# EAGLE design RE-MB-V2.1 (EAGLE 9.6.2)
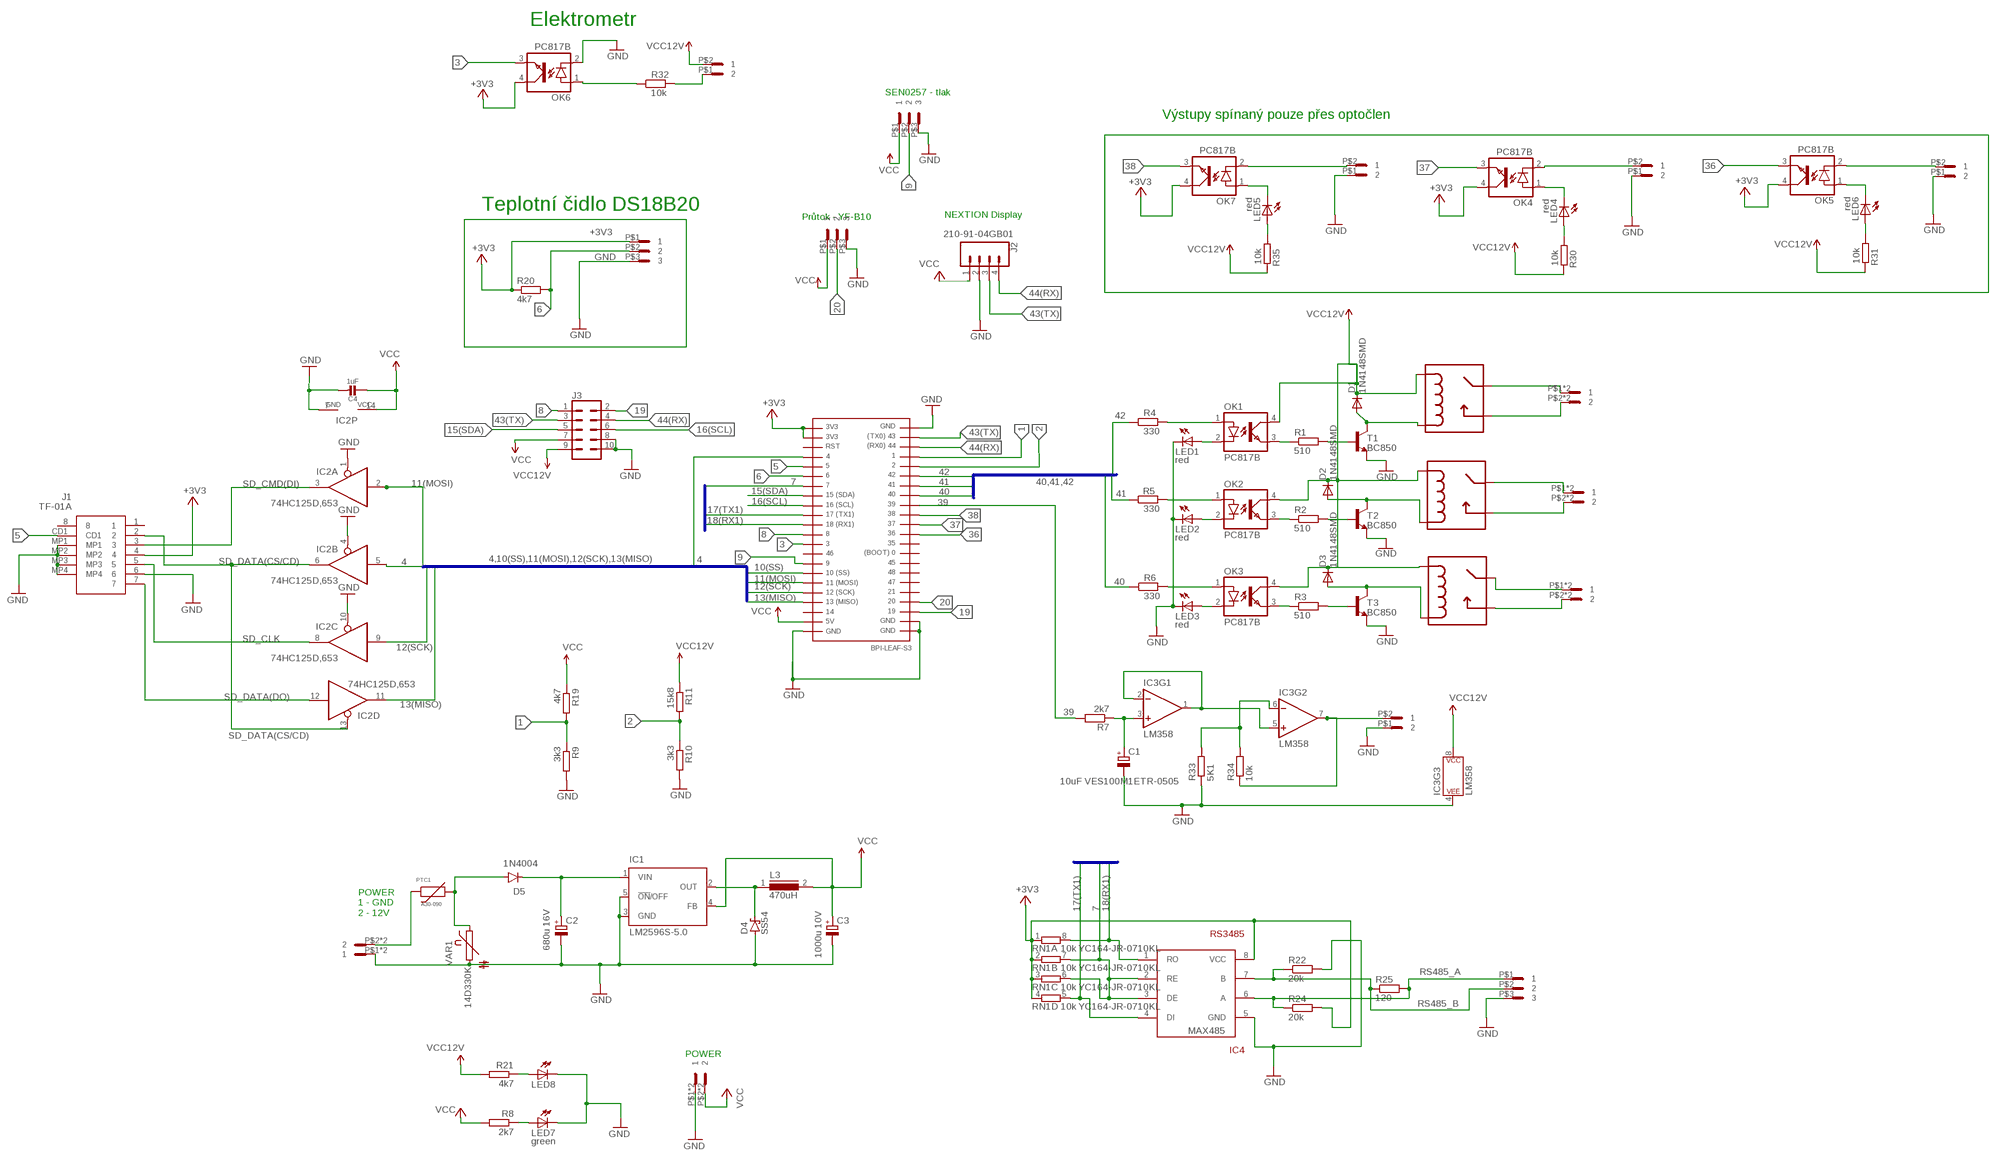
[diagram p0: schematic, sheet 1]

## Parts
BPI  BPI-LEAF-S3  [BPI-LEAF-S3]
C1  10uF VES100M1ETR-0505  CPOL-EUC  [PANASONIC_C]
C2  680u 16V  CPOL-EU153CLV-1010  [153CLV-1010]
C3  1000u 10V  CPOL-EU153CLV-1010  [153CLV-1010]
C4  1uF  CAP_CERAMIC0805-NOOUTLINE  [0805-NO]
D1  1N4148SMD  [DO214AC]
D2  1N4148SMD  [DO214AC]
D3  1N4148SMD  [DO214AC]
D4  SS54  MBRS130LT3  [SMB]
D5  1N4004  [DO41-10]
IC1  LM2596S-5.0  LM2596S  [TO263-5]
IC2  74HC125D,653  74HC125D  [SO14]
IC3  LM358  OPAMP-DUALU  [SO08]
IC4  RS3485  MAX485MAX485ESA  [MAX485]
J1  TF-01A  [TF01A]
J2  210-91-04GB01  CONN_04  [1X04]
J3  CONN_05X2RAF  [2X5-RAF]
K1  HF49FD/012-1H11  HF49FD/024-1H11  [HF49FD/024-1H11]
K2  HF49FD/012-1H11  HF49FD/024-1H11  [HF49FD/024-1H11]
K3  HF49FD/012-1H11  HF49FD/024-1H11  [HF49FD/024-1H11]
L3  470uH  DR127  [DR127]
LED1  red  LEDCHIPLED_0805  [CHIPLED_0805]
LED2  red  LEDCHIPLED_0805  [CHIPLED_0805]
LED3  red  LEDCHIPLED_0805  [CHIPLED_0805]
LED4  red  LEDCHIPLED_0805  [CHIPLED_0805]
LED5  red  LEDCHIPLED_0805  [CHIPLED_0805]
LED6  red  LEDCHIPLED_0805  [CHIPLED_0805]
LED7  green  LEDCHIPLED_0805  [CHIPLED_0805]
LED8  green  LEDCHIPLED_0805  [CHIPLED_0805]
OK1  PC817B  PC817  [DIL04]
OK2  PC817B  PC817  [DIL04]
OK3  PC817B  PC817  [DIL04]
OK4  PC817B  PC817  [DIL04]
OK5  PC817B  PC817  [DIL04]
OK6  PC817B  PC817  [DIL04]
OK7  PC817B  PC817  [DIL04]
PTC1  A30-090  TERMISTORPK250-240  [PK250-240]
R1  510  R-EU_M0805  [M0805]
R2  510  R-EU_M0805  [M0805]
R3  510  R-EU_M0805  [M0805]
R4  330  R-EU_M0805  [M0805]
R5  330  R-EU_M0805  [M0805]
R6  330  R-EU_M0805  [M0805]
R7  2k7  R-EU_R0805  [R0805]
R8  2k7  R-EU_M0805  [M0805]
R9  3k3  R-EU_M0805  [M0805]
R10  3k3  R-EU_M0805  [M0805]
R11  15k8  R-EU_M0805  [M0805]
R19  4k7  R-EU_M0805  [M0805]
R20  4k7  R-EU_M0805  [M0805]
R21  4k7  R-EU_M0805  [M0805]
R22  20k  R-EU_R0805  [R0805]
R24  20k  R-EU_R0805  [R0805]
R25  120  R-EU_R0805  [R0805]
R30  10k  R-EU_M0805  [M0805]
R31  10k  R-EU_M0805  [M0805]
R32  10k  R-EU_M0805  [M0805]
R33  5K1  R-EU_R0805  [R0805]
R34  10k  R-EU_R0805  [R0805]
R35  10k  R-EU_M0805  [M0805]
RN1  10k YC164-JR-0710KL  4R-N0603-ARV  [0603-ARV]
T1  BC850  [SOT23]
T2  BC850  [SOT23]
T3  BC850  [SOT23]
U$2  DG235-5.0  [DG235-5.0]
U$3  SPTA1/3-5,0  [SPTA1/3-5,0]
U$4  DG235-5.0  [DG235-5.0]
U$5  DG235-5.0  [DG235-5.0]
U$6  DG235-5.0  [DG235-5.0]
U$7  DG235-5.0  [DG235-5.0]
U$8  SPTA1/2-5,0  [SPTA1/2-5,0]
U$9  SPTA1/2-5,0  [SPTA1/2-5,0]
U$10  SPTA1/3-5,0  [SPTA1/3-5,0]
U$12  SPTA1/3-5,0  [SPTA1/3-5,0]
U$13  SPTA1/2-5,0  [SPTA1/2-5,0]
U$14  SPTA1/2-5,0  [SPTA1/2-5,0]
U$15  SPTA1/2-5,0  [SPTA1/2-5,0]
U$16  SPTA1/3-5,0  [SPTA1/3-5,0]
VAR1  14D330K  S10K11  [S10K11]

## Nets
1: BPI.26 R9.1 R19.2
2: BPI.27 R10.1 R11.2
3: BPI.13 OK6.3(EMIT)
4: BPI.4 IC2.5(B:I)
5: BPI.5 J1.CD1
6: BPI.6 R20.2 U$3.P$2
7: BPI.7 IC4.2(RE) IC4.3(DE) RN1.6 RN1.7
8: BPI.12 J3.1
9: BPI.15 U$12.P$2
10(SS): BPI.16
11(MOSI): BPI.17 IC2.2(A:I)
12(SCK): BPI.18 IC2.9(C:I)
13(MISO): BPI.19 IC2.11(D:O)
15(SDA): BPI.8 J3.5
16(SCL): BPI.9 J3.6
17(TX1): BPI.10 IC4.4(DI) RN1.5
18(RX1): BPI.11 IC4.1(RO) RN1.8
19: BPI.42 J3.2
20: BPI.41 U$16.P$2
36: BPI.34 OK5.3(EMIT)
37: BPI.33 OK4.3(EMIT)
38: BPI.32 OK7.3(EMIT)
39: BPI.31 R7.2
40: BPI.30 R6.1
41: BPI.29 R5.1
42: BPI.28 R4.1
43(TX): BPI.24 J2.3 J3.3
44(RX): BPI.25 J2.4 J3.4
+3V3: BPI.1 BPI.2 IC4.8(VCC) J1.4 OK4.4(COL) OK5.4(COL) OK6.4(COL) OK7.4(COL) R20.1 R24.2 RN1.1 RN1.2 RN1.3 RN1.4 U$3.P$1
GND: BPI.22 BPI.23 BPI.43 BPI.44 C1.- C2.- C3.- C4.2 D4.A IC1.3(GND) IC1.5(!ON!/OFF) IC2.1(A:OE) IC2.4(B:OE) IC2.7(P:GND) IC2.10(C:OE) IC3.4(P$V-) IC4.5(GND) J1.6 J1.MP1 J1.MP2 J1.MP3 J1.MP4 J2.2 J3.8 J3.10 LED1.C LED2.C LED3.C LED7.C LED8.C OK6.2(C) R9.2 R10.2 R22.2 R33.1 T1.2(E) T2.2(E) T3.2(E) U$2.P$1 U$2.P$3 U$3.P$3 U$6.P$1 U$6.P$3 U$8.P$1 U$10.P$3 U$12.P$3 U$13.P$1 U$14.P$1 U$15.P$1 U$16.P$3 VAR1.2
GND1: OK4.2(C) U$13.P$2
N$1: PTC1.P$1 U$2.P$2 U$2.P$4
N$2: K1.P$1 U$4.P$1 U$4.P$3
N$3: D5.A PTC1.P$2 VAR1.1
N$5: K1.P$2 U$4.P$2 U$4.P$4
N$6: K2.P$1 U$5.P$1 U$5.P$3
N$7: K2.P$2 U$5.P$2 U$5.P$4
N$8: K3.P$1 U$7.P$1 U$7.P$3
N$9: K3.P$2 U$7.P$2 U$7.P$4
N$10: OK7.2(C) U$15.P$2
N$11: LED4.C OK4.1(A)
N$12: LED4.A R30.1
N$13: OK5.2(C) U$14.P$2
N$14: LED6.C OK5.1(A)
N$15: LED6.A R31.1
N$16: OK6.1(A) R32.1
N$17: LED1.A OK1.2(C)
N$18: D1.A K1.P$4 T1.3(C)
N$19: OK1.3(EMIT) R1.1
N$20: C1.+ IC3.3(+IN) R7.1
N$22: IC3.1(OUT) IC3.2(-IN) IC3.5(+IN)
N$23: R1.2 T1.1(B)
N$24: R32.2 U$9.P$1
N$25: LED7.A R8.1
N$29: OK1.1(A) R4.2
N$33: LED8.A R21.1
N$40: D4.C IC1.2(OUT) L3.1
N$41: IC3.6(-IN) R33.2 R34.2
N$42: IC3.7(OUT) R34.1 U$8.P$2
N$51: LED2.A OK2.2(C)
N$52: LED3.A OK3.2(C)
N$58: OK3.1(A) R6.2
N$59: OK2.1(A) R5.2
N$65: OK2.3(EMIT) R2.1
N$66: OK3.3(EMIT) R3.1
N$77: R3.2 T3.1(B)
N$78: R2.2 T2.1(B)
N$79: D2.A K2.P$4 T2.3(C)
N$80: D3.A K3.P$4 T3.3(C)
N$91: LED5.C OK7.1(A)
N$92: LED5.A R35.1
RS485_A: IC4.6(A) R24.1 R25.2 U$10.P$1
RS485_B: IC4.7(B) R22.1 R25.1 U$10.P$2
SD_CLK: IC2.8(C:O) J1.5
SD_CMD(DI): IC2.3(A:O) J1.3
SD_DATA(CS/CD): IC2.6(B:O) IC2.13(D:OE) J1.2
SD_DATA(DO): IC2.12(D:I) J1.7
VCC: BPI.21 C3.+ C4.1 IC1.4(FB) IC2.14(P:VCC) J2.1 J3.7 L3.2 R8.2 R19.1 U$6.P$2 U$6.P$4 U$12.P$1 U$16.P$1
VCC12V: C2.+ D1.C D2.C D3.C D5.C IC1.1(VIN) IC3.8(P$V+) J3.9 K1.P$3 K2.P$3 K3.P$3 OK1.4(COL) OK2.4(COL) OK3.4(COL) R11.1 R21.2 R30.2 R31.2 R35.2 U$9.P$2
Unconnected: BPI.3 BPI.14 BPI.20 BPI.35 BPI.36 BPI.37 BPI.38 BPI.39 BPI.40 J1.1 J1.8

## Buses
4,10(SS),11(MOSI),12(SCK),13(MISO)
40,41,42
7,17(TX1),18(RX1)

## Notes on the sheet
- Elektrometr
- SEN0257 - tlak
- Výstupy spínaný pouze přes optočlen
- Teplotní čidlo DS18B20 | NEXTION Display
- Průtok - YF-B10
- POWER
  1 - GND
  2 - 12V
- POWER

## Library data of the parts
BPI = SparkFun-Connectors:BPI-LEAF-S3
C1 = resistor:CPOL-EU: POLARIZED CAPACITOR, European symbol
C2 C3 = rcl:CPOL-EU: POLARIZED CAPACITOR, European symbol
C4 = microbuilder:CAP_CERAMIC: Ceramic Capacitors For new designs, use the packages preceded by an '_' character since they are more reliable: The following footprints should be used on most boards: _0402 - Standard footprint for regular board layouts _0603 - Standard footprint for regular board layouts _0805 - Standard footprint for regular board layouts _1206 - Standard footprint for regular board layouts For extremely tight-pitch boards where space is at a premium, the following 'micro-pitch' footprints can be used (smaller pads, no silkscreen outline, etc.): _0402MP - Micro-pitch footprint for very dense/compact boards _0603MP - Micro-pitch footprint for very dense/compact boards _0805MP - Micro-pitch footprint for very dense/compact boards _1206MP - Micro-pitch footprint for very dense/compact boards
D1-D3 = diode-1:1N4148: DIODE high speed (Philips)
D4 = diode:MBRS130LT3: Schottky Power Rectifier Source: http://www.onsemi.com/pub/Collateral/MBRS130LT3-D.PDF
D5 = diode:1N4004: DIODE general purpose rectifier, 1 A
IC1 = national-semiconductor:LM2596: SIMPLE SWITCHER® Power Converter 150 kHz 3A Step-Down Voltage Regulator Source: http://www.national.com/ds/LM/LM2596.pdf; MF: NATIONAL SEMICONDUCTOR; MPN: LM2596S-ADJ/NOPB; OC_FARNELL: 9494367; OC_NEWARK: 41K3842
IC2 = 74xx-eu:74*125: Quad bus BUFFER, 3-state; SPICEPREFIX: J
IC3 = SparkFun-IC-Amplifiers:OPAMP-DUAL: Generic op-amp footprint This component is for the standard 358 pinning of a dual op-amp From the LM358 datasheet: Pin 1: Output A Pin 2: Inverting Input A Pin 3: Non-Inverting Input A Pin 4: Gnd Pin 5: Non-Inverting Input B Pin 6: Inverting Input B Pin 7: Output B Pin 8: V+; PROD_ID: NA-XXXXX; VALUE: OP-AMP
IC4 = gasparik:MAX485
J1 = TF-01A:TF-01A: Connector - Card Sockets 8 1.1mm SMD RoHS Source: Datasheet <https://datasheet.lcsc.com/szlcsc/1903221101_Korean-Hroparts-Elec-TF-01A_C91145.pdf>; DESCRIPTION: Connector - Card Sockets 8 1.1mm SMD RoHS; HEIGHT: 1.85mm; MANUFACTURER_NAME: Korean Hroparts Elec; MANUFACTURER_PART_NUMBER: TF-01A
J2 = SparkFun-Connectors:CONN_04: Multi connection point. Often used as Generic Header-pin footprint for 0.1 inch spaced/style header connections On any of the 0.1 inch spaced packages, you can populate with these: Break Away Headers - Straight <https://www.sparkfun.com/products/116> (PRT-00116) Break Away Male Headers - Right Angle <https://www.sparkfun.com/products/553> (PRT-00553) Female Headers <https://www.sparkfun.com/products/115> (PRT-00115) Break Away Headers - Machine Pin <https://www.sparkfun.com/products/117> (PRT-00117) Break Away Female Headers - Swiss Machine Pin <https://www.sparkfun.com/products/743> (PRT-00743) For SCREWTERMINALS and SPRING TERMINALS visit here: Screw Terimnals on SparkFun.com <https://www.sparkfun.com/search/results?term=Screw+Terminals> (5mm/3.5mm/2.54mm spacing) This device is also useful as a general connection point to wire up your design to another part of your project. Our various solder wires solder well into these plated through hole pads. Hook-Up Wire - Assortment (Stranded, 22 AWG) <https://www.sparkfun.com/products/11375> (PRT-11375) Hook-Up Wire - Assortment (Solid Core, 22 AWG) <https://www.sparkfun.com/products/11367> (PRT-11367) View the entire wire category on our website here <https://www.sparkfun.com/categories/141> Special notes: Molex polarized connector foot print use with SKU : PRT-08231 with associated crimp pins and housings. 1MM SMD Version SKU: PRT-10208; PROD_ID: CONN-09696
J3 = SparkFun-Connectors:CONN_05X2: Multi connection point. Often used as Generic Header-pin footprint for 0.1 inch spaced/style header connections For AVR SPI programming port, see special device with nice symbol: "AVR_SPI_PROG_5x2.dev" You can populate with any combo of single row headers, but if you'd like an exact match, check these: 2x5 AVR ICSP Male Header <https://www.sparkfun.com/products/778> (PRT-00778) 2x5 Pin Shrouded Header <https://www.sparkfun.com/products/8506> (PRT-08506) On any of the 0.1 inch spaced packages, you can populate with these: Break Away Headers - Straight <https://www.sparkfun.com/products/116> (PRT-00116) Break Away Male Headers - Right Angle <https://www.sparkfun.com/products/553> (PRT-00553) Female Headers <https://www.sparkfun.com/products/115> (PRT-00115) Break Away Headers - Machine Pin <https://www.sparkfun.com/products/117> (PRT-00117) Break Away Female Headers - Swiss Machine Pin <https://www.sparkfun.com/products/743> (PRT-00743) Special note: the shrouded connector mates well with our 5x2 ribbon cables: 2x5 Pin IDC Ribbon Cable <https://www.sparkfun.com/products/8535> (PRT-08535)
K1-K3 = HF49FD0241H11:HF49FD/024-1H11
L3 = inductors:DR127: High Power Density, High Efficiency, Shielded Inductors Source: coiltronics_dr_series.pdf; SPICEPREFIX: L
LED1-LED8 = adafruit:LED: LED OSRAM: - CHIPLED LG R971, LG N971, LY N971, LG Q971, LY Q971, LO R971, LY R971 LH N974, LH R974 LS Q976, LO Q976, LY Q976 LO Q996 - Hyper CHIPLED LW Q18S LB Q993, LB Q99A, LB R99A - SideLED LS A670, LO A670, LY A670, LG A670, LP A670 LB A673, LV A673, LT A673, LW A673 LH A674 LY A675 LS A676, LA A676, LO A676, LY A676, LW A676 LS A679, LY A679, LG A679 - Hyper Micro SIDELED® LS Y876, LA Y876, LO Y876, LY Y876 LT Y87S - SmartLED LW L88C, LW L88S LB L89C, LB L89S, LG L890 LS L89K, LO L89K, LY L89K LS L896, LA L896, LO L896, LY L896 - TOPLED LS T670, LO T670, LY T670, LG T670, LP T670 LSG T670, LSP T670, LSY T670, LOP T670, LYG T670 LG T671, LOG T671, LSG T671 LB T673, LV T673, LT T673, LW T673 LH T674 LS T676, LA T676, LO T676, LY T676, LB T676, LH T676, LSB T676, LW T676 LB T67C, LV T67C, LT T67C, LS T67K, LO T67K, LY T67K, LW E67C LS E67B, LA E67B, LO E67B, LY E67B, LB E67C, LV E67C, LT E67C LW T67C LS T679, LY T679, LG T679 LS T770, LO T770, LY T770, LG T770, LP T770 LB T773, LV T773, LT T773, LW T773 LH T774 LS E675, LA E675, LY E675, LS T675 LS T776, LA T776, LO T776, LY T776, LB T776 LHGB T686 LT T68C, LB T68C - Hyper Mini TOPLED® LB M676 - Mini TOPLED Santana® LG M470 LS M47K, LO M47K, LY M47K Source: http://www.osram.convergy.de/
OK1-OK7 = optocoupler:PC817: SHARP OPTO COUPLER; MPN: PC817X4J000F; OC_FARNELL: 9707727; OC_NEWARK: 97K7059
PTC1 = gasparik:TERMISTOR
R1-R11 R19-R22 R24 R25 R30-R35 = resistor:R-EU_: RESISTOR, European symbol
RN1 = resistor-dil:4R-N: Array Chip Resistor Source: RS Component / Phycomp; OC_FARNELL: unknown; OC_NEWARK: unknown
T1-T3 = transistor:BC850: NPN TRANSISTOR
U$2 U$4-U$7 = SparkFun-Connectors:DG235-5.0
U$3 U$10 U$12 U$16 = SparkFun-Connectors:SPTA1/3-5,0
U$8 U$9 U$13-U$15 = SparkFun-Connectors:SPTA1/2-5,0
VAR1 = varistor:S10K11: VARISTOR

## Board
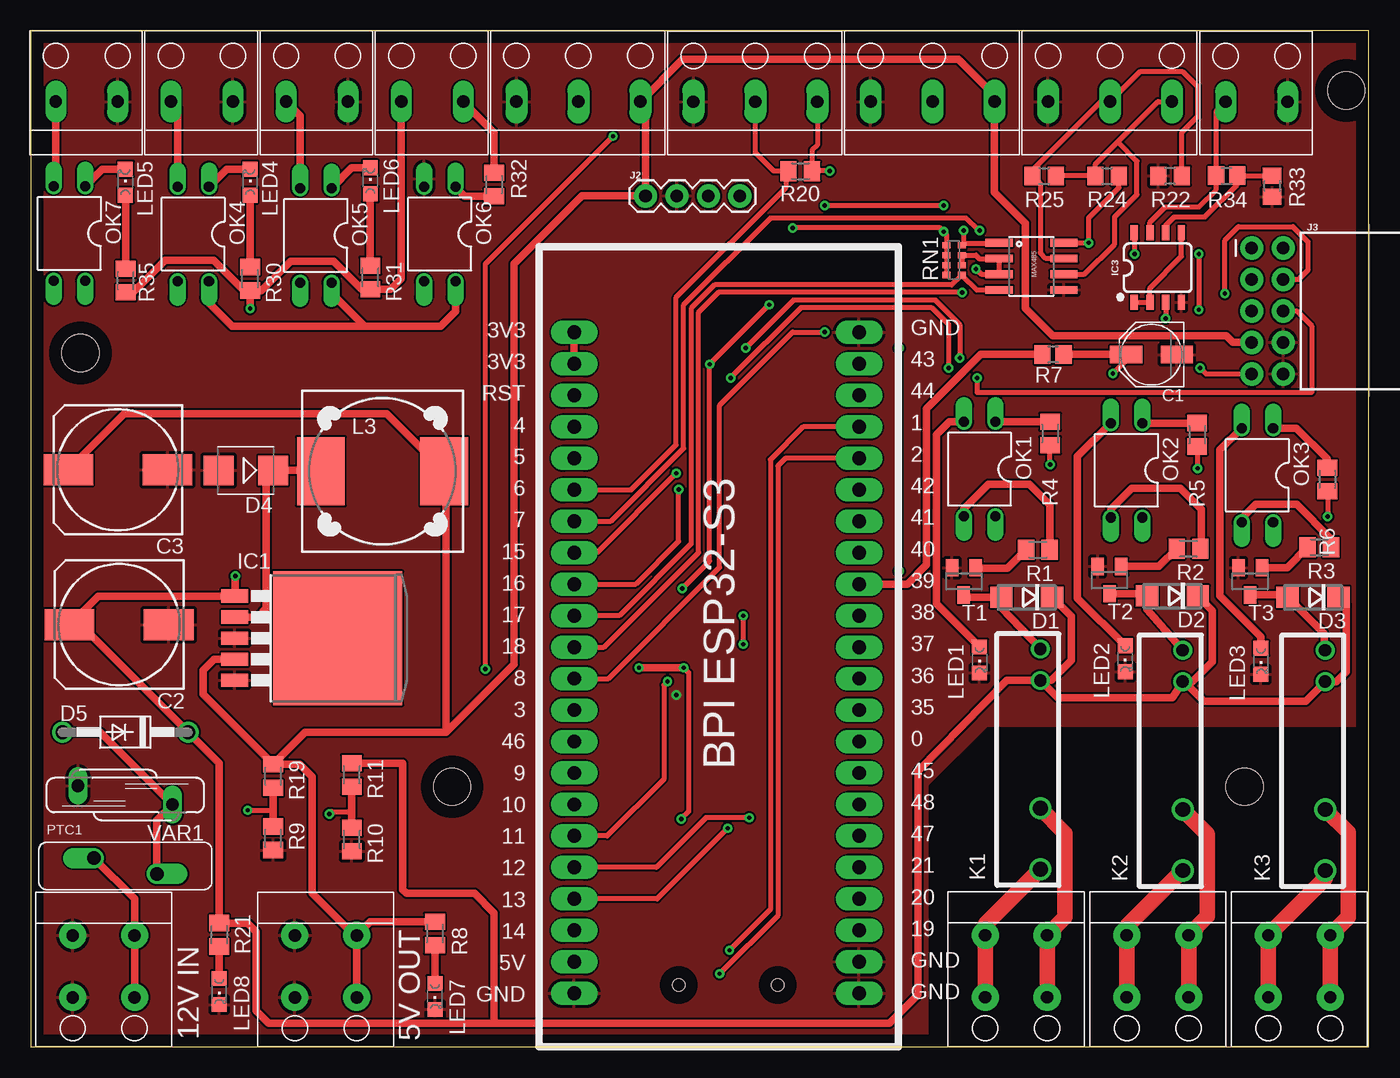
[diagram p1: board, top side]
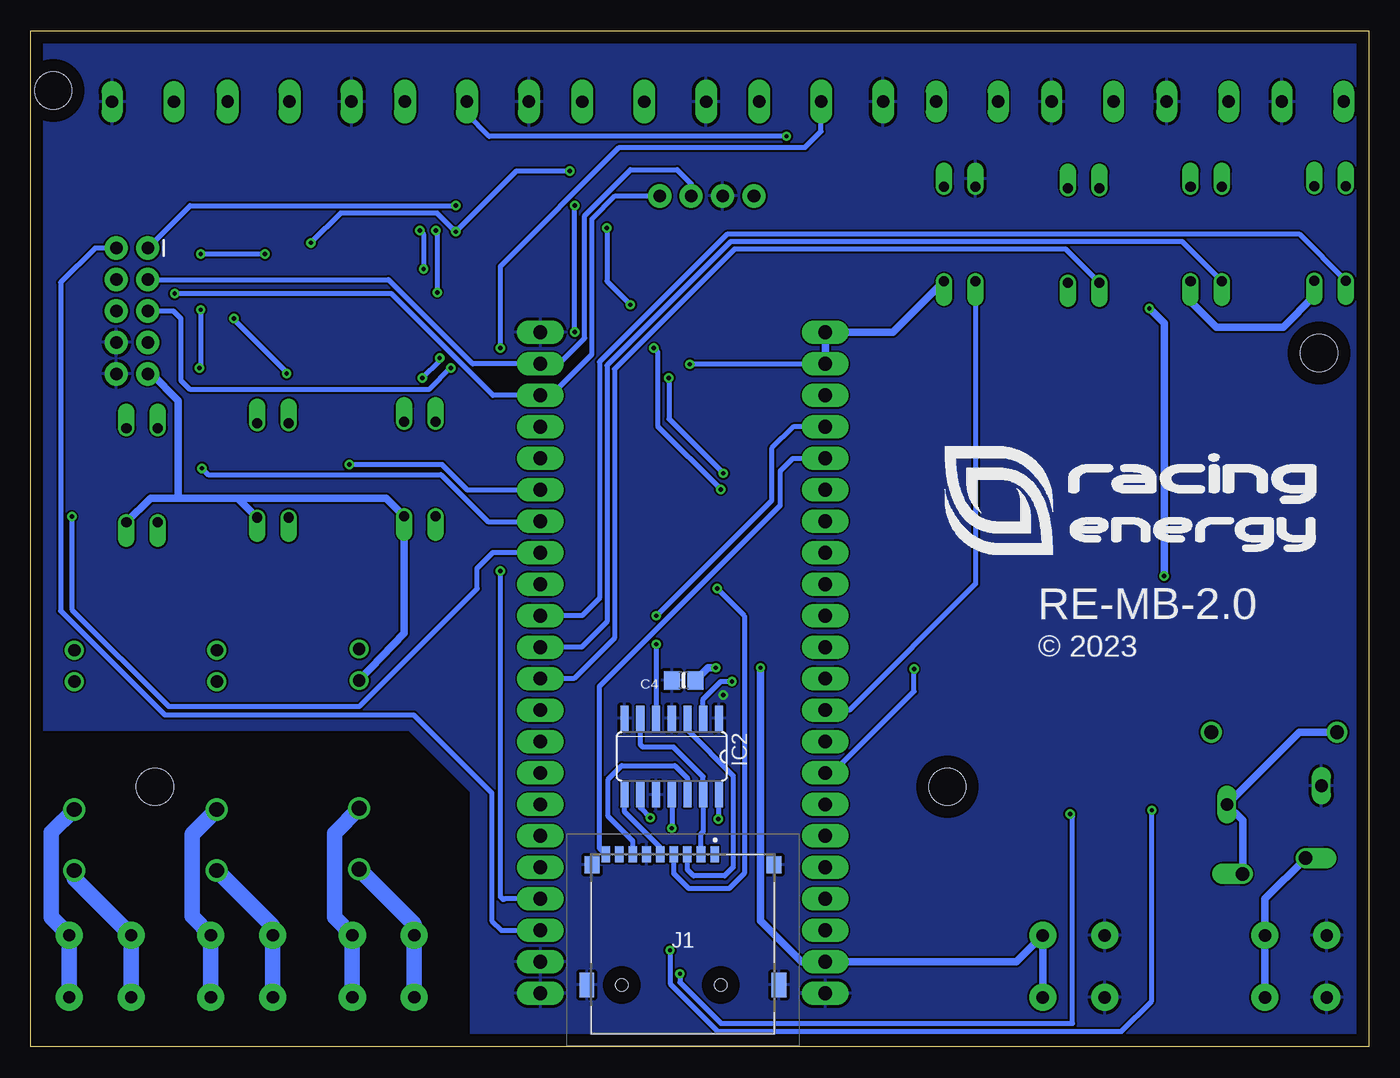
[diagram p2: board, bottom side, seen from below]

Size 108 x 82 mm. Coordinates in mm from the lower left corner, seen from the top.
Outline: 0,0 108,0 108,82 0,82 0,0
Copper layers (1*16): Top 0.035mm / dielectric 1.5mm / Bottom 0.035mm
Design rules "default": minimum track width 6mil, minimum drill 0.35mm, track to track 6mil, track to pad 6mil, pad to pad 6mil, via to via 6mil, smd to smd 6mil, copper to edge 40mil, drill to drill 6mil, minimum pad ring 10mil, minimum via ring 8mil, stop-mask expansion 4mil, vias tented up to drill 0mil, thermal gap 10mil
Holes 3 mm at 4,56 98,21 34,21 106.2,77.2

### Footprints (pad centres in the part's own frame; a part is rotated, then mirrored left to right if it is on the bottom)
BPI-LEAF-S3 = drill 1.118 pad 1.88 long: 1 -11.46,24.65; 2 -11.46,22.11; 3 -11.46,19.57; 4 -11.46,17.03; 5 -11.46,14.49; 6 -11.46,11.95; 7 -11.46,9.41; 8 -11.46,6.87; 9 -11.46,4.33; 10 -11.46,1.79; 11 -11.46,-0.75; 12 -11.46,-3.29; 13 -11.46,-5.83; 14 -11.46,-8.37; 15 -11.46,-10.91; 16 -11.46,-13.45; 17 -11.46,-15.99; 18 -11.46,-18.53; 19 -11.46,-21.07; 20 -11.46,-23.61; 21 -11.46,-26.15; 22 -11.46,-28.69; 23 11.54,24.65; 24 11.54,22.11; 25 11.54,19.57; 26 11.54,17.03; 27 11.54,14.49; 28 11.54,11.95; 29 11.54,9.41; 30 11.54,6.87; 31 11.54,4.33; 32 11.54,1.79; 33 11.54,-0.75; 34 11.54,-3.29; 35 11.54,-5.83; 36 11.54,-8.37; 37 11.54,-10.91; 38 11.54,-13.45; 39 11.54,-15.99; 40 11.54,-18.53; 41 11.54,-21.07; 42 11.54,-23.61; 43 11.54,-26.15; 44 11.54,-28.69
PANASONIC_C = smd 2.6 x 1.4: + 2.05,0; - -2.05,0
153CLV-1010 = smd 4 x 2.5: + 4,0; - -4,0
0805-NO = smd 1.3 x 1.5: 1 -0.95,0; 2 0.95,0
DO214AC = smd 1.8 x 1.7: A 2.05,0; C -2.05,0
SMB = smd 2.4 x 2.4: A 2.2,0; C -2.2,0
DO41-10 = drill 1.118: A 5.08,0; C -5.08,0
TO263-5 = smd 1.067 x 2.159: 1 -3.404,-5.791; 2 -1.702,-5.791; 3 0,-5.791; 4 1.702,-5.791; 5 3.404,-5.791 | smd 10.8 x 10.41: 6 0,2.54
SO14 = smd 0.66 x 2.032: 1 -3.81,-3.073; 2 -2.54,-3.073; 3 -1.27,-3.073; 4 0,-3.073; 5 1.27,-3.073; 6 2.54,-3.073; 7 3.81,-3.073; 8 3.81,3.073; 9 2.54,3.073; 10 1.27,3.073; 11 0,3.073; 12 -1.27,3.073; 13 -2.54,3.073; 14 -3.81,3.073
SO08 = smd 0.6 x 1.2: 1 -1.905,-2.8; 2 -0.635,-2.8; 3 0.635,-2.8; 4 1.905,-2.8; 5 1.905,2.8; 6 0.635,2.8; 7 -0.635,2.8; 8 -1.905,2.8
MAX485 = smd 0.61 x 2.21: 1 1.905,-6.426; 2 3.175,-6.426; 3 4.445,-6.426; 4 5.715,-6.426; 5 5.715,-1.194; 6 4.445,-1.194; 7 3.175,-1.194; 8 1.905,-1.194
TF01A = smd 0.7 x 1.3: 1 2.56,7.25; 2 1.46,7.25; 3 0.36,7.25; 4 -0.74,7.25; 5 -1.84,7.25; 6 -2.94,7.25; 7 -4.04,7.25; 8 -5.14,7.25; CD1 -6.24,7.25 | smd 1.2 x 1.4: MP1 -7.34,6.4; MP4 7.34,6.4 | smd 1.2 x 2: MP2 -7.76,-3.3; MP3 7.76,-3.3 | hole 1: -4.95,-3.3; 3.05,-3.3
1X04 = drill 1.016 pad 1.88: 1 0,0; 2 2.54,0; 3 5.08,0; 4 7.62,0
2X5-RAF = drill 1.016 pad 1.88: 1 -1.27,5.08; 2 1.27,5.08; 3 -1.27,2.54; 4 1.27,2.54; 5 -1.27,0; 6 1.27,0; 7 -1.27,-2.54; 8 1.27,-2.54; 9 -1.27,-5.08; 10 1.27,-5.08
HF49FD/024-1H11 = drill 1.2: P$1 -8,0; P$2 -3.08,0 | drill 1: P$3 7.24,0; P$4 9.78,0
DR127 = smd 3.85 x 5.5: 1 -4.975,0; 2 4.975,0
CHIPLED_0805 = smd 1.2 x 1.2: A 0,-1.05; C 0,1.05
DIL04 = drill 0.813 offset: 1 -1.27,-3.81; 2 1.27,-3.81; 3 1.27,3.81; 4 -1.27,3.81
PK250-240 = drill 1.1 offset: P$1 -2.54,1.27; P$2 2.54,0
M0805 = smd 1.3 x 1.6: 1 -0.95,0; 2 0.95,0
R0805 = smd 1.3 x 1.5: 1 -0.85,0; 2 0.85,0
R0805' = smd 1.3 x 1.5: 1 -0.95,0; 2 0.95,0
0603-ARV = smd 0.5 x 0.65: 1 -1.2,-0.625; 2 -0.4,-0.625; 3 0.4,-0.625; 4 1.2,-0.625; 5 1.2,0.625; 6 0.4,0.625; 7 -0.4,0.625; 8 -1.2,0.625
SOT23 = smd 1 x 1.4: 1 -0.95,-1.1; 2 0.95,-1.1; 3 0,1.1
DG235-5.0 = drill 1 pad 2.184: P$1 3,4; P$2 8,4; P$3 3,9; P$4 8,9
SPTA1/3-5,0 = drill 1 pad 1.778 long: P$1 2,5.7; P$2 7,5.7; P$3 12,5.7
SPTA1/2-5,0 = drill 1 pad 1.676 long: P$1 2,5.7; P$2 7,5.7
S10K11 = drill 1.016 long: 1 -0.762,-3.81; 2 0.762,3.81

### Placement (x,y rotation side)
BPI  55.33,33.02 0 top
C1  90.48,55.88 180 top
C2  7.12,34.09 180 top
C3  7.02,46.59 180 top
C4  55.3,29.59 180 bottom
D1  80.4,36.31 180 top
D2  92.16,36.41 180 top
D3  103.52,36.31 180 top
D4  17.35,46.53 180 top
D5  7.62,25.4 180 top
IC1  22.23,32.99 270 top
IC2  56.26,23.44 180 bottom
IC3  90.98,62.9 0 top
IC4  84.59,66.81 270 top
J1  55.36,8.3 0 bottom
J2  49.62,68.68 0 top
J3  99.84,59.4 0 top
K1  81.5,22.34 90 top
K2  93,22.24 90 top
K3  104.5,22.24 90 top
L3  28.38,46.46 0 top
LED1  76.59,31.23 180 top
LED2  88.35,31.33 180 top
LED3  99.31,31.13 180 top
LED4  17.7,69.8 0 top
LED5  7.62,69.8 0 top
LED6  27.4,69.9 0 top
LED7  32.62,4.07 180 top
LED8  15.2,4.47 180 top
OK1  76.6,46.64 180 top
OK2  88.46,46.54 180 top
OK3  99.02,46.14 180 top
OK4  13.1,65.6 180 top
OK5  23,65.5 180 top
OK6  33,65.6 180 top
OK7  3.1,65.66 180 top
PTC1  7.62,13.97 0 top
R1  81.3,40.12 180 top
R2  93.46,40.22 180 top
R3  104.02,40.32 180 top
R4  82.29,49.51 90 top
R5  94.16,49.41 90 top
R6  104.67,45.81 90 top
R7  82.53,55.89 180 top
R8  32.62,9.15 90 top
R9  19.56,16.84 270 top
R10  25.91,16.74 270 top
R11  25.91,21.96 270 top
R19  19.56,21.86 270 top
R20  62.12,70.68 180 top
R21  15.2,9.05 90 top
R22  20k  [R0805']  91.98,70.3 180 top
R24  20k  [R0805']  86.9,70.3 0 top
R25  120  [R0805']  81.82,70.3 0 top
R30  17.7,62 270 top
R31  27.4,62.1 270 top
R32  37.4,69.6 90 top
R33  100.22,69.48 90 top
R34  96.54,70.32 0 top
R35  7.65,61.85 270 top
RN1  74.53,63.5 270 top
T1  75.32,37.58 180 top
T2  87.08,37.68 180 top
T3  98.44,37.58 180 top
U$2  0.37,0 0 top
U$3  65.49,81.99 180 top
U$4  74.05,0.01 0 top
U$5  85.48,0.01 0 top
U$6  18.3,0 0 top
U$7  96.91,0.01 0 top
U$8  103.46,81.99 180 top
U$9  36.9,82 180 top
U$10  94.12,82 180 top
U$12  79.8,82 180 top
U$13  18.3,82 180 top
U$14  27.6,82 180 top
U$15  9,82 180 top
U$16  51.2,82 180 top
VAR1  7.62,20.32 90 top

### Tracks (layer width: path | path; a pad name or v marks a point on that pad's centre or on a via)
1  (via drill 0.35)
  Top 0.406: BPI.26 62.35,50.05 59.7,47.4 59.7,11.1 v56.4,7.8 | v17.5,19.1 19.56,19.1
  Top 0.61: R19.2 19.56,19.1 R9.1
  Bottom 0.406: v56.4,7.8 56.4,5.1 52.56,1.26 19.94,1.26 17.5,3.7 v17.5,19.1
2  (via drill 0.35)
  Top 0.406: BPI.27 60.91,47.51 60.3,46.9 60.3,10.6 v55.6,5.9 | v24.1,18.8 24.3,19 25.91,19
  Top 0.61: R11.2 25.91,19 R10.1
  Bottom 0.406: v55.6,5.9 55.6,5.2 52.3,1.9 23.9,1.9 23.9,18.6 v24.1,18.8
3
  Bottom 0.406: OK6.3 31.73,37.37 41.91,27.19 BPI.13
4  (via drill 0.35)
  Top 0.406: v57.5,34.8 v57.5,32.5
  Bottom 0.406: BPI.4 46.45,50.05 48.2,48.3 48.2,44.1 v57.5,34.8 | v57.5,32.5 57.53,32.47 IC2.5
5
  Bottom 0.406: J1.CD1 62.1,16.05 62.1,29.1 47.5,43.7 47.5,46.5 46.49,47.51 BPI.5
6
  Top 0.406: BPI.6 48.47,44.97 52.1,48.6 52.1,60.5 61,69.4 61,70.68 | R20.2 61,70.68 | 61,70.68 59.98,70.68 58.49,72.17 U$3.P$2
7  (via drill 0.35)
  Top 0.406: BPI.7 46.83,42.43 52.7,48.3 52.7,59.9 59.7,66.9 75.5,66.9 76.5,65.9 v76.6,65.9 | v76.3,62.8 76.73,62.37 IC4.3 IC4.2 78.13,63.6 76.6,63.6 76.3,63.9 RN1.7 RN1.6
  Bottom 0.406: v76.6,65.9 76.3,65.6 v76.3,62.8
8  (via drill 0.35)
  Top 0.406: BPI.12 46.63,29.73 55.6,38.7 55.6,51.8 61.5,57.7 v64.1,57.7 | v73.7,67.9 v64.1,67.9
  Bottom 0.406: J3.1 95.15,67.9 v73.7,67.9 | v64.1,57.7 v64.1,67.9
9  (via drill 0.35)
  Top 0.406: v36.7,30.5 36.7,63.2 v47,73.5
  Bottom 0.406: BPI.15 43.29,22.11 36.7,28.7 v36.7,30.5 | v47,73.5 71,73.5 72.8,75.3 U$12.P$2
11(MOSI)  (via drill 0.35)
  Top 0.406: v51.4,29.5 51.1,29.2 51.1,21.6 46.53,17.03 BPI.17
  Bottom 0.406: IC2.2 53.72,28.08 52.3,29.5 v51.4,29.5
12(SCK)  (via drill 0.35)
  Top 0.406: BPI.18 50.49,14.49 54.5,18.5 v58,18.5
  Bottom 0.406: IC2.9 58.8,19.3 v58,18.5
13(MISO)  (via drill 0.35)
  Top 0.406: v56.25,17.65 50.55,11.95 BPI.19
  Bottom 0.406: IC2.11 v56.26,17.65 v56.25,17.65
15(SDA)  (via drill 0.35)
  Top 0.406: BPI.8 45.69,39.89 v52.1,46.3 | v56.5,54 62.2,59.7 72.7,59.7 74.1,58.3 v74.1,54.8
  Bottom 0.406: J3.5 96.5,59.4 95.9,58.8 95.9,53.8 95.2,53.1 75.8,53.1 v74.1,54.8 | v52.1,46.3 56.5,50.7 v56.5,54
16(SCL)  (via drill 0.35)
  Top 0.406: J3.6 102.2,59.4 103.4,58.2 103.4,52.8 76.4,52.8 v76.4,54 | BPI.9 48.85,37.35 52.3,40.8 v52.3,45 | v57.7,56.4 61.6,60.3 73,60.3 75,58.3 v75,55.6
  Bottom 0.406: v52.3,45 57.4,50.1 57.4,56.1 v57.7,56.4 | v76.4,54 75,55.4 v75,55.6
17(TX1)
  Top 0.406: IC4.4 76.36,61.09 RN1.5 74.36,61.5 55.2,61.5 53.3,59.6 53.3,40.6 47.51,34.81 BPI.10
18(RX1)  (via drill 0.35)
  Top 0.406: BPI.11 46.27,32.27 53.9,39.9 53.9,59.3 55.5,60.9 v75.2,60.9 | v75.3,65.9 75.3,64.84 | 75.3,64.84 RN1.8 | IC4.1 78.1,64.84 75.3,64.84
  Bottom 0.406: v75.2,60.9 75.2,65.8 v75.3,65.9
19
  Bottom 0.406: J3.2 102.82,64.48 105.6,61.7 105.6,35.2 97.2,26.8 77.1,26.8 70.8,20.5 70.8,10.2 70.01,9.41 BPI.42
20  (via drill 0.35)
  Top 0.406: v70.1,56.4 v70.1,38.4
  Bottom 0.406: BPI.41 69.75,11.95 69.8,11.9 69.9,11.9 70.1,12.1 v70.1,38.4 | v70.1,56.4 70.1,63 60.5,72.6 45.5,72.6 44.2,73.9 U$16.P$2
36
  Bottom 0.406: OK5.3 24.44,64.4 51.2,64.4 60.9,54.7 60.9,33 64.17,29.73 BPI.34
37
  Bottom 0.406: OK4.3 15.04,65 51.5,65 61.5,55 61.5,34.3 63.53,32.27 BPI.33
38
  Bottom 0.406: OK7.3 5.57,65.58 51.81,65.58 62.1,55.3 62.1,36.2 63.49,34.81 BPI.32
39
  Top 0.61: R7.2 76.69,55.89 72.3,51.5 72.3,38.9 70.75,37.35 BPI.31
40  (via drill 0.35)
  Top 0.406: R6.1 104.7,44.83 v104.7,42.8
  Bottom 0.406: v104.7,42.8 104.7,35.3 96.89,27.49 81.47,27.49 71.97,36.99 72,37.02 72,38.6 70.71,39.89 BPI.30
41  (via drill 0.35)
  Top 0.406: R5.1 94.16,46.74 v94.2,46.7
  Bottom 0.406: v94.2,46.7 93.7,46.2 74.9,46.2 71.1,42.4 66.9,42.4 BPI.29
42  (via drill 0.35)
  Top 0.406: v82.3,47 v82.29,47.01 R4.1
  Bottom 0.406: v82.3,47 74.8,47 72.77,44.97 BPI.28
43(TX)
  Bottom 0.406: J3.3 79.14,61.94 72.33,55.13 BPI.24 65.37,55.13 63.3,57.2 63.3,67.1 59.6,70.8 55.82,70.8 54.7,69.68 J2.3
44(RX)  (via drill 0.35)
  Top 0.406: v96.4,60.8 96.4,65.1 97.5,66.2 101.9,66.2 103.1,65 103.1,62.7 102.34,61.94 J3.4
  Bottom 0.406: v96.4,60.8 78.9,60.8 70.69,52.59 BPI.25 66.01,52.59 62.7,55.9 62.7,66.82 60.84,68.68 J2.4
+3V3  (via drill 0.35)
  Top 0.406: R24.2 87.85,69.36 85.4,66.91 v85.4,64.9 83.6,64.9 83.59,64.91 IC4.8 | RN1.4 RN1.3 RN1.2 RN1.1 73.9,65.6 v73.7,65.8 73.4,66.1 v61.5,66.1 | v52.6,37 54.8,39.2 v54.8,55.1 v59.6,59.9 | U$3.P$1 63.49,72.79 63.08,72.38 R20.1 63.09,70.7 v64.5,70.7
  Top 0.61: OK5.4 24.27,60.83 26.93,58.17 | OK4.4 14.37,60.03 16.23,58.17 26.93,58.17 | BPI.1 BPI.2 | 26.93,58.17 33.07,58.17 34.27,59.37 OK6.4
  Bottom 0.406: J1.4 56.1,14 54.9,12.8 51.6,12.8 50.4,14 50.4,34.8 v52.6,37 | v54.8,55.1 54.77,55.13 BPI.2 | v61.5,66.1 61.5,61.8 v59.6,59.9 | v85.4,64.9 83,67.3 75.2,67.3 v73.7,65.8 68.8,70.7 v64.5,70.7
  Bottom 0.61: OK7.4 4.37,60.63 6.9,58.1 12.3,58.1 14.37,60.17 OK4.4 | OK6.4 38.39,57.67 BPI.1 BPI.2
GND  (via drill 0.35)
  other vias: 52.1,28.4
  pour Top: -0.6,82.4 108.5,82.4 108.5,25.9 77.2,25.9 72.4,21.1 72.4,-0.3 72.3,-0.4 -0.7,-0.4 -0.7,82.3
  pour Bottom: -0.7,82.4 108.5,82.4 108.5,25.6 77.5,25.6 72.5,20.6 72.5,-0.2 72.3,-0.4 -0.7,-0.4
GND1
  Top 0.61: OK4.2 11.83,75.77 U$13.P$2
N$1
  Top 0.61: U$2.P$2 U$2.P$4 8.37,11.95 PTC1.P$1
  Bottom 0.61: PTC1.P$1 8.37,11.95 U$2.P$4 U$2.P$2
N$2
  Top 1.27: U$4.P$1 U$4.P$3 77.05,9.89 K1.P$1
  Bottom 1.27: U$4.P$1 U$4.P$3 77.05,9.89 K1.P$1
N$3
  Top 0.61: PTC1.P$2 10.16,18.29 VAR1.1 5.59,25.4 D5.A
  Bottom 0.61: PTC1.P$2 10.16,18.29 VAR1.1 5.59,25.4 D5.A
N$5
  Top 1.27: K1.P$2 83.5,17.26 83.5,10.46 U$4.P$4 U$4.P$2
  Bottom 1.27: K1.P$2 83.5,17.26 83.5,10.46 U$4.P$4 U$4.P$2
N$6
  Top 1.27: U$5.P$1 U$5.P$3 88.48,9.72 K2.P$1
  Bottom 1.27: U$5.P$1 U$5.P$3 88.48,9.72 K2.P$1
N$7
  Top 1.27: K2.P$2 95,17.16 95,10.53 U$5.P$4 U$5.P$2
  Bottom 1.27: K2.P$2 95,17.16 95,10.53 U$5.P$4 U$5.P$2
N$8
  Top 1.27: K3.P$1 104.5,13.6 U$7.P$3 U$7.P$1
  Bottom 1.27: K3.P$1 104.5,13.6 U$7.P$3 U$7.P$1
N$9
  Top 1.27: K3.P$2 106.35,17.31 106.35,10.45 U$7.P$4 U$7.P$2
  Bottom 1.27: K3.P$2 106.35,17.31 106.35,10.45 U$7.P$4 U$7.P$2
N$10
  Top 0.61: U$15.P$2 2,69.64 OK7.2
N$11
  Top 0.61: OK4.1 15.81,70.85 LED4.C
N$12
  Top 0.61: LED4.A R30.1
N$13
  Top 0.61: OK5.2 21.73,75.17 U$14.P$2
N$14
  Top 0.61: OK5.1 25.91,70.95 LED6.C
N$15
  Top 0.61: LED6.A R31.1
N$16
  Top 0.61: OK6.1 35.03,68.65 R32.1
N$17
  Top 0.61: LED1.A 73.1,35.77 73.1,49.4 74.15,50.45 OK1.2
N$18
  Top 0.61: K1.P$4 78.35,35.44 D1.A 75.49,36.31 T1.3
N$19
  Top 0.61: OK1.3 75.33,43.43 77.3,45.4 80.6,45.4 82.25,43.75 R1.1
N$20  (via drill 0.35)
  Top 0.406: IC3.3 91.61,58.81 v91.6,58.8 | v87.35,54.35 88.43,55.43 C1.+
  Top 0.61: R7.1 C1.+
  Bottom 0.406: v91.6,58.8 91.6,58.7 87.35,54.45 v87.35,54.35
N$22
  Top 0.406: IC3.5 92.9,65.69 92.9,63.8 90.34,61.24 IC3.2 IC3.1
N$23
  Top 0.61: T1.1 76.33,38.62 78.85,38.62 R1.2
N$24
  Top 0.61: U$9.P$1 37.4,73.8 R32.2
N$25
  Top 0.61: R8.1 LED7.A
N$29
  Top 0.61: R4.2 OK1.1
N$33
  Top 0.61: R21.1 LED8.A
N$40
  Top 0.406: L3.1 23.48,46.53 24.07,46.53 | D4.C 19.22,46.2 19,46.2
  Top 0.61: IC1.2 18.29,34.69 19,35.4 19,46.2 | D4.C 24.07,46.53
N$41
  Top 0.406: IC3.6 91.61,66.31 92.3,67 94.8,67 97.39,69.59 R34.2 R33.2
N$42
  Top 0.406: IC3.7 90.34,66.55 91.6,67.8 94.3,67.8 95.69,69.19 R34.1 95.69,75.52 U$8.P$2
N$51
  Top 0.61: OK2.2 84.5,47.66 84.5,36.23 LED2.A
N$52
  Top 0.61: OK3.2 96,48.2 96,36.4 99.31,33.09 LED3.A
N$58
  Top 0.61: OK3.1 102.18,49.95 104.67,47.46 R6.2
N$59
  Top 0.61: OK2.1 R5.2
N$65
  Top 0.61: OK2.3 87.19,43.39 88.9,45.1 92.8,45.1 94.5,43.4 94.5,40.31 R2.1
N$66
  Top 0.61: OK3.3 97.75,42.65 98.9,43.8 102.2,43.8 104.97,41.03 R3.1
N$77
  Top 0.61: T3.1 101.43,38.68 R3.2
N$78
  Top 0.61: T2.1 91.07,38.78 R2.2
N$79
  Top 0.61: T2.3 89.94,36.58 D2.A 90.11,35.34 K2.P$4
N$80
  Top 0.61: T3.3 101.3,36.48 D3.A 104.39,33.39 K3.P$4
N$91
  Top 0.61: OK7.1 5.75,70.85 LED5.C
N$92
  Top 0.61: R35.1 7.65,68.72 LED5.A
RS485_A
  Top 0.406: 87.75,73.05 85.95,71.25 R24.1 R25.2 | 87.75,73.05 91,76.3 U$10.P$1 | IC4.6 85.06,62.37 87.5,64.8 87.5,67 89.3,68.8 89.3,71.5 87.75,73.05
RS485_B
  Top 0.406: R22.1 92.93,73.83 94.2,75.1 94.2,77.5 93,78.7 89.52,78.7 U$10.P$2 86.4,76.3 80.87,70.77 R25.1 81.5,69.67 81.5,64.1 81.97,63.63 IC4.7
SD_CLK
  Bottom 0.406: J1.5 57.2,16.1 60.07,18.97 IC2.8
SD_CMD(DI)
  Bottom 0.406: IC2.3 54.99,25.59 51.3,21.9 51.3,14.5 52,13.8 54.5,13.8 55,14.3 J1.3
SD_DATA(CS/CD)
  Bottom 0.406: J1.2 53.9,17.2 53.7,17.4 53.7,20.35 IC2.13 53.72,21.82 56.1,24.2 58.6,24.2 58.8,24.4 IC2.6
SD_DATA(DO)
  Bottom 0.406: J1.7 59.4,16.6 61.4,18.6 61.4,21.6 60.3,22.7 56,22.7 54.99,21.69 IC2.12
VCC  (via drill 0.35)
  Top 0.406: v52.7,30.6 53.1,30.2 53.1,19 v52.5,18.4
  Top 0.61: U$6.P$2 U$6.P$4 | R19.1 21.69,22.81 22.7,21.8 22.7,12.4 26.1,9 U$6.P$4 | R19.1 22.15,25.4 33.5,25.4 | 33.5,25.4 39,30.9 39,63.2 44.48,68.68 J2.1 49.62,75.88 U$16.P$1 52.6,79.7 74.9,79.7 77.8,76.8 U$12.P$1 77.8,69 80.3,66.5 80.3,59.6 82.5,57.4 96.5,57.4 97.04,56.86 J3.7 | IC1.4 14.79,31.29 13.9,30.4 13.9,28.47 R19.1 | C3.+ 7.53,51.1 28.71,51.1 L3.2 33.5,46.31 33.5,25.4 | U$6.P$4 27.4,10.1 R8.2 | v49.1,30.6 v52.7,30.6
  Bottom 0.406: v52.5,18.4 52.45,18.45 IC2.14
  Bottom 0.61: U$6.P$2 U$6.P$4 28.43,6.87 BPI.21 45.77,6.87 49.1,10.2 v49.1,30.6 | v52.7,30.6 53.34,30.6 C4.1
VCC12V  (via drill 0.35)
  Top 0.406: IC3.8 89.1,65.67 v89.1,64 | v94.3,64 v94.3,59.5 | v94.4,54.8 94.88,54.32 J3.9
  Top 0.61: R30.2 17.2,61.05 14.75,63.5 10.85,63.5 8.25,60.9 R35.2 | R30.2 18.6,61.05 20.95,63.4 24.45,63.4 26.7,61.15 R31.2 29.05,61.15 29.9,62 U$9.P$2 | R11.1 30.02,22.91 30.02,12.7 30.32,12.4 35.8,12.4 37.4,10.8 37.4,2 37.3,1.9 | K1.P$3 82.38,29.58 84,31.2 84,34.76 D1.C | K2.P$3 93.78,29.48 95.4,31.1 95.4,35.22 D2.C | K2.P$3 93.43,29.17 94.7,27.9 102.92,27.9 K3.P$3 105.38,29.48 106.2,30.3 106.2,35.68 D3.C | K2.P$3 92.15,28.2 82.9,28.2 81.67,29.43 K1.P$3 | K1.P$3 78.82,29.58 71.6,22.23 71.6,4.2 69.3,1.9 37.3,1.9 | 37.3,1.9 19.2,1.9 18.2,2.9 18.2,9.3 17.5,10 R21.2 15.2,22.9 D5.C 4.01,34.09 C2.+ 5.42,36.39 IC1.1 16.5,36.45 v16.5,38 | R30.2 v17.7,59.6
  Bottom 0.406: v94.3,59.5 94.3,54.9 v94.4,54.8 | v94.3,64 v89.1,64
  Bottom 0.61: J3.9 98.27,54.32 96.1,52.15 96.1,44.3 | K1.P$3 77.87,33.38 OK1.4 79.34,44.3 91.3,44.3 | 91.3,44.3 96.1,44.3 | OK2.4 91.3,44.3 | OK3.4 98.32,44.3 96.1,44.3 | v17.7,59.6 16.5,58.4 v16.5,38

### Text on the board
tPlace: 12V IN | 5V OUT
bPlace: RE-MB-2.0 | © 2023